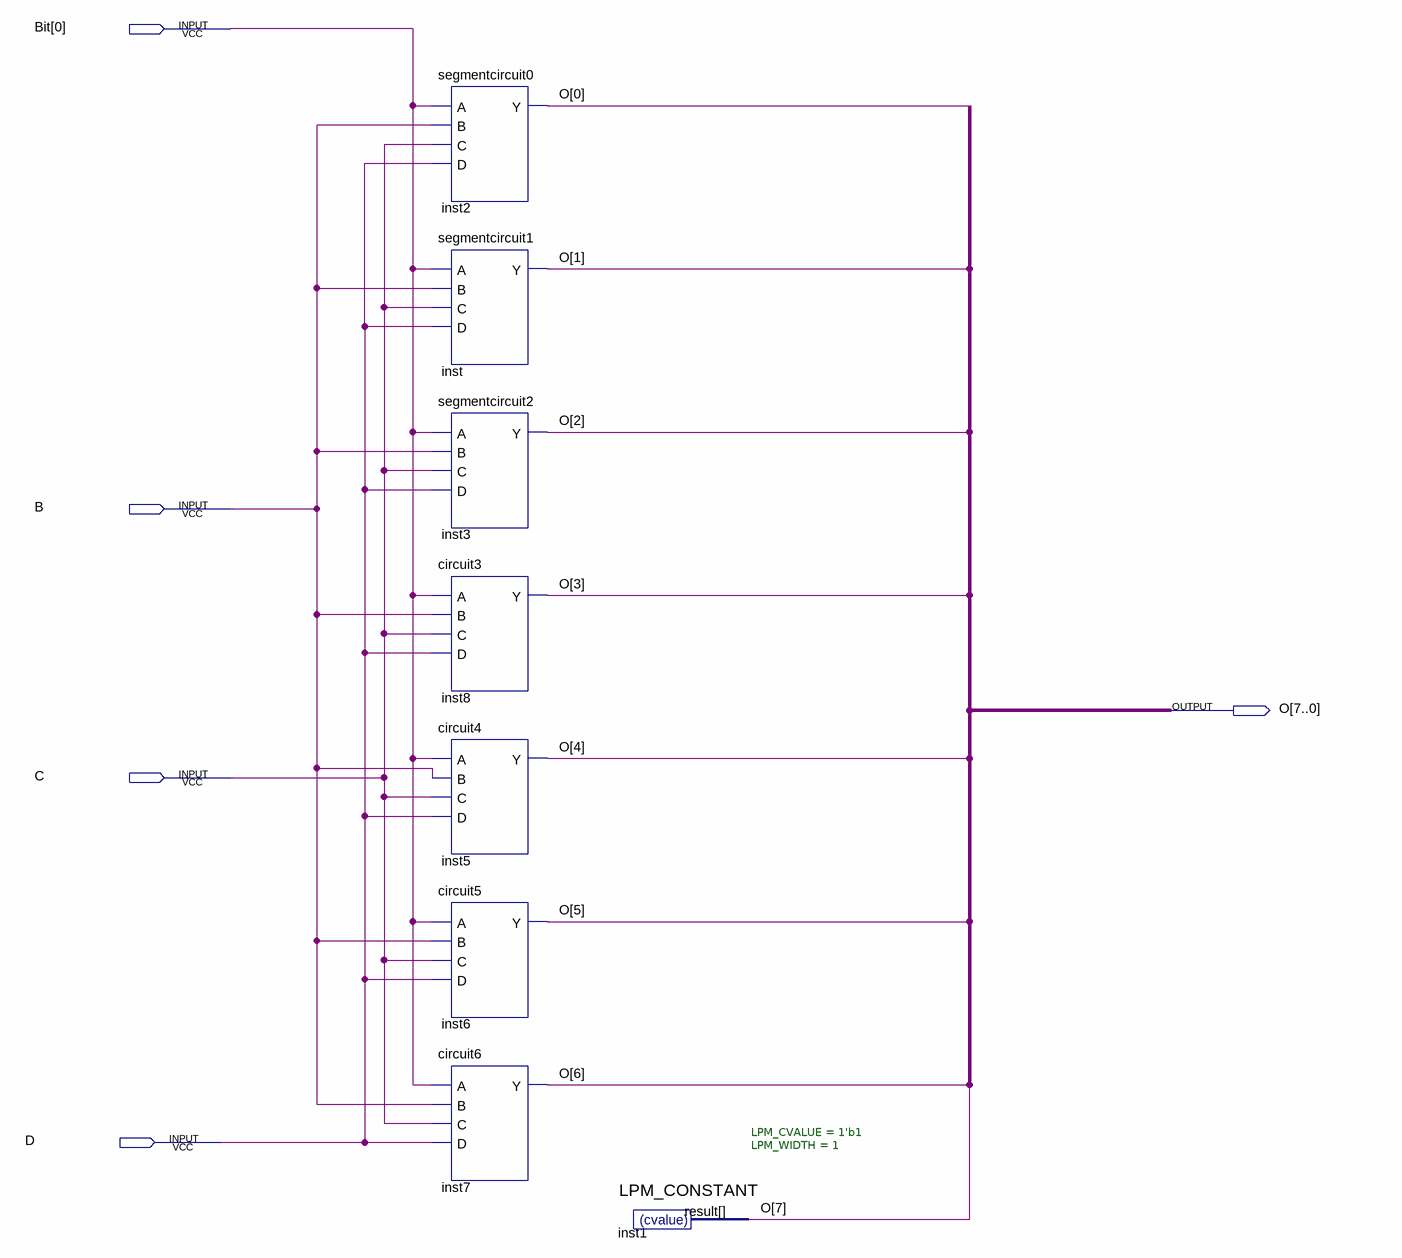
[diagram p0: schematic sheet]
// Quartus schematic sevensegmentcircuit2.bdf as structural Verilog: 8 symbols, 5 pins
module sevensegmentcircuit2 (
  input  [0:0] Bit,
  input  B,
  input  C,
  input  D,
  output [7:0] O
);

  segmentcircuit0 inst2 (.A(Bit[0]), .B(B), .C(C), .D(D), .Y(O[0]));
  segmentcircuit1 inst (.A(Bit[0]), .B(B), .C(C), .D(D), .Y(O[1]));
  segmentcircuit2 inst3 (.A(Bit[0]), .B(B), .C(C), .D(D), .Y(O[2]));
  circuit3 inst8 (.A(Bit[0]), .B(B), .C(C), .D(D), .Y(O[3]));
  circuit4 inst5 (.A(Bit[0]), .B(B), .C(C), .D(D), .Y(O[4]));
  circuit5 inst6 (.A(Bit[0]), .B(B), .C(C), .D(D), .Y(O[5]));
  circuit6 inst7 (.A(Bit[0]), .B(B), .C(C), .D(D), .Y(O[6]));
  LPM_CONSTANT #(.LPM_CVALUE(1'b1), .LPM_WIDTH(1)) inst1 (.result(O[7]));
endmodule
